# Altium schematic sheet pca10100_sheet4_interface_mcu.SchDoc: PCA10100 - Interface MCU
size A3; Organization: Nordic Semiconductor; DocumentNumber: 4; SheetNumber: 4; SheetTotal: 7; CompanyName: Nordic Semiconductor
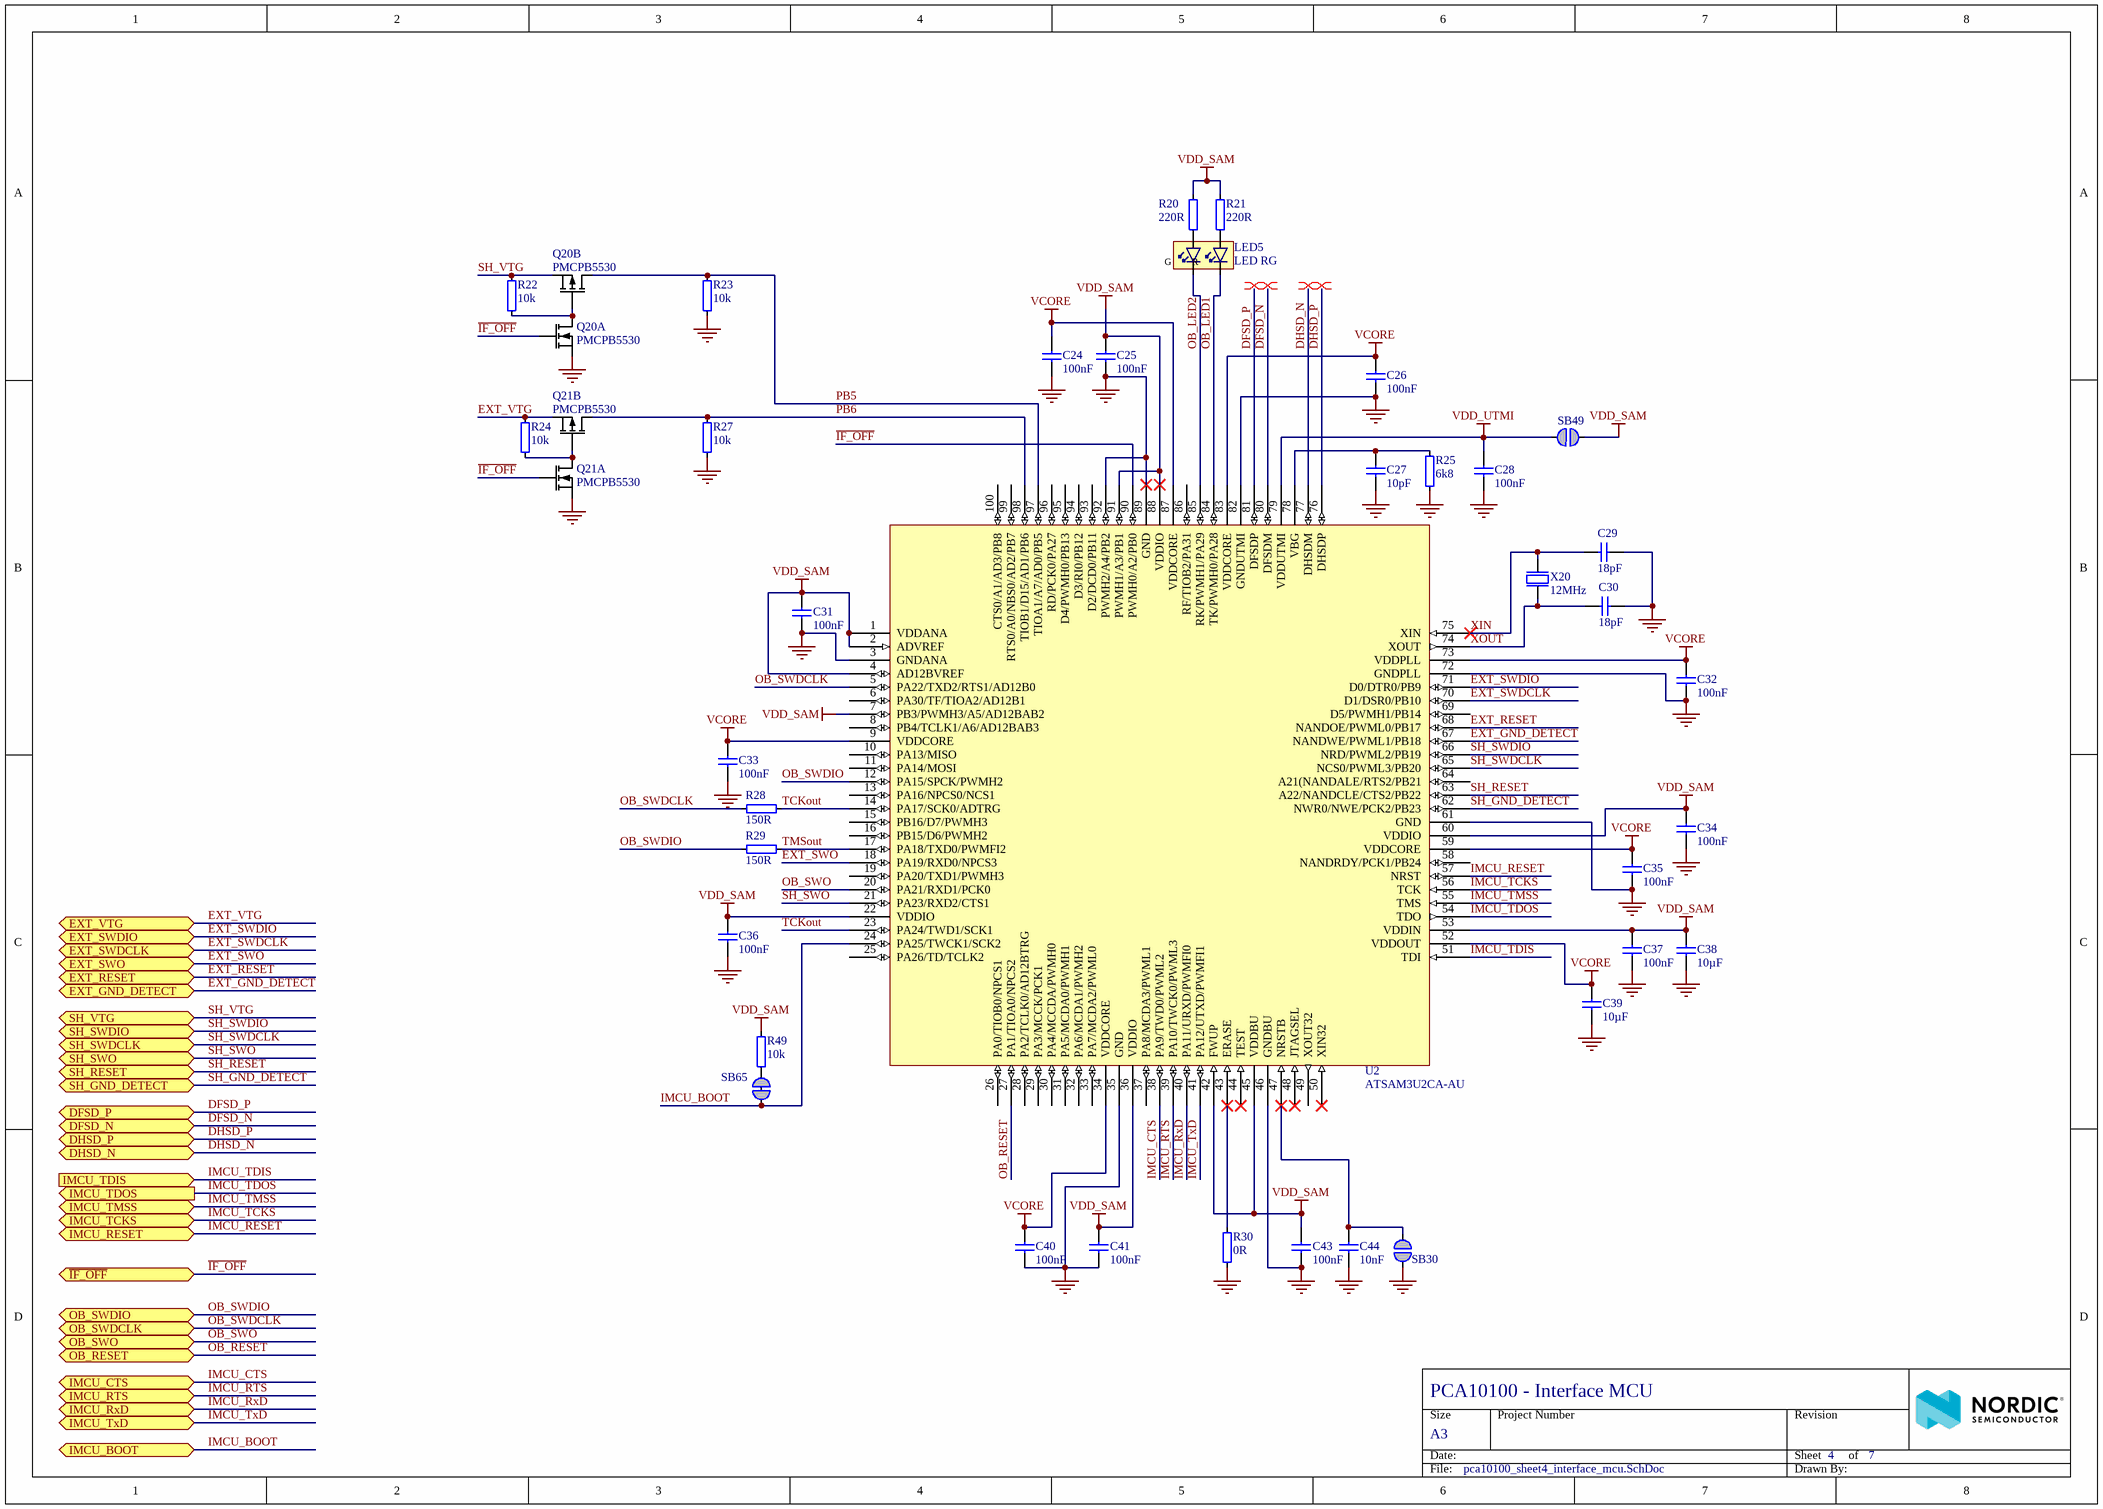
[diagram p0: pca10100_sheet4_interface_mcu.SchDoc]

## Parts
C24  100nF  [CAPC0603X03L_C]
C25  100nF  [CAPC0603X03L_C]
C26  100nF  [CAPC0603X03L_C]
C27  10pF  [CAPC0603X03L_C]
C28  100nF  [CAPC0603X03L_C]
C29  18pF  [CAPC0603X03L_C]
C30  18pF  [CAPC0603X03L_C]
C31  100nF  [CAPC0603X03L_C]
C32  100nF  [CAPC0603X03L_C]
C33  100nF  [CAPC0603X03L_C]
C34  100nF  [CAPC0603X03L_C]
C35  100nF  [CAPC0603X03L_C]
C36  100nF  [CAPC0603X03L_C]
C37  100nF  [CAPC0603X03L_C]
C38  10µF  [CAPC1608X06L]
C39  10µF  [CAPC1608X06L]
C40  100nF  [CAPC0603X03L_C]
C41  100nF  [CAPC0603X03L_C]
C43  100nF  [CAPC0603X03L_C]
C44  10nF  [CAPC0603X03L_C]
LED5  LED RG  [LED_DUAL_0606]
Q20  PMCPB5530  [DFN65P200X200X80_HS-6N]  (parts A,B of 2)
Q21  PMCPB5530  [DFN65P200X200X80_HS-6N]  (parts A,B of 2)
R20  220R  [RESC0603X03L_C]
R21  220R  [RESC0603X03L_C]
R22  10k  [RESC0603X03L_C]
R23  10k  [RESC0603X03L_C]
R24  10k  [RESC0603X03L_C]
R25  6k8  [RESC0603X03L_C]
R27  10k  [RESC0603X03L_C]
R28  150R  [RESC0603X03L_C]
R29  150R  [RESC0603X03L_C]
R30  0R  [RESC0603X03L_C]
R49  10k  [RESC0603X03L_C]
SB30  Solderbridge  [Solderbridge]  (value not drawn)  (no BOM)
SB49  Solderbridge  [Solderbridge]  (value not drawn)  (no BOM)
SB65  Solderbridge  [Solderbridge_Shorted]  (value not drawn)  (net tie, no BOM)
U2  ATSAM3U2CA-AU  [TSQFP50P1600X1600X160-100N]
X20  12MHz  [BT-XTAL_3225]

## Ports
DFSD_N (bidir), DFSD_P (bidir), DHSD_N (bidir), DHSD_P (bidir), EXT_GND_DETECT (bidir), EXT_RESET (bidir), EXT_SWDCLK (bidir), EXT_SWDIO (bidir), EXT_SWO (bidir), EXT_VTG (bidir), IMCU_BOOT (bidir), IMCU_CTS (bidir), IMCU_RESET (bidir), IMCU_RTS (bidir), IMCU_RxD (bidir), IMCU_TCKS (bidir), IMCU_TDIS (in), IMCU_TDOS (out), IMCU_TMSS (bidir), IMCU_TxD (bidir), OB_RESET (bidir), OB_SWDCLK (bidir), OB_SWDIO (bidir), OB_SWO (bidir), SH_GND_DETECT (bidir), SH_RESET (bidir), SH_SWDCLK (bidir), SH_SWDIO (bidir), SH_SWO (bidir), SH_VTG (bidir), ~{IF_OFF} (bidir)

## Nets
GND: C24.1 C25.1 C26.1 C27.1 C28.1 C29.2 C30.2 C31.1 C32.2 C33.1 C34.1 C35.1 C36.1 C37.1 C38.1 C39.1 C40.1 C41.1 C43.1 C44.1 Q20.1(S1) Q21.1(S1) R23.1 R25.1 R27.1 R30.1 SB30.2 U2.3(GNDANA) U2.35(GND) U2.46(GNDBU) U2.61(GND) U2.72(GNDPLL) U2.82(GNDUTMI) U2.89(GND) U2.92(PWMH2/A4/PB2) X20.2(GND) X20.4(GND)
VCORE: C24.2 C26.2 C32.1 C33.2 C35.2 C39.2 C40.2 U2.9(VDDCORE) U2.34(VDDCORE) U2.52(VDDOUT) U2.59(VDDCORE) U2.73(VDDPLL) U2.83(VDDCORE) U2.87(VDDCORE)
VDD_SAM: C25.2 C31.2 C34.2 C36.2 C37.2 C38.2 C41.2 C43.2 R20.2 R21.2 R49.2 SB49.1 U2.1(VDDANA) U2.2(ADVREF) U2.4(AD12BVREF) U2.7(PB3/PWMH3/A5/AD12BAB2) U2.22(VDDIO) U2.36(VDDIO) U2.42(FWUP) U2.45(VDDBU) U2.53(VDDIN) U2.60(VDDIO) U2.88(VDDIO) U2.91(PWMH1/A3/PB1)
VDD_UTMI: C28.2 SB49.2 U2.79(VDDUTMI)
DFSD_N: U2.80(DFSDM) ; port DFSD_N
DFSD_P: U2.81(DFSDP) ; port DFSD_P
DHSD_N: U2.77(DHSDM) ; port DHSD_N
DHSD_P: U2.76(DHSDP) ; port DHSD_P
EXT_GND_DETECT: U2.67(NANDWE/PWML1/PB18) ; port EXT_GND_DETECT
EXT_RESET: U2.68(NANDOE/PWML0/PB17) ; port EXT_RESET
EXT_SWDCLK: U2.70(D1/DSR0/PB10) ; port EXT_SWDCLK
EXT_SWDIO: U2.71(D0/DTR0/PB9) ; port EXT_SWDIO
EXT_SWO: U2.18(PA19/RXD0/NPCS3) ; port EXT_SWO
EXT_VTG: Q21.4(S2) R24.1 ; port EXT_VTG
~{IF_OFF}: Q20.2(G1) Q21.2(G1) U2.90(PWMH0/A2/PB0) ; port ~{IF_OFF}
IMCU_BOOT: SB65.1 U2.24(PA25/TWCK1/SCK2) ; port IMCU_BOOT
IMCU_CTS: U2.38(PA9/TWD0/PWML2) ; port IMCU_CTS
IMCU_RESET: U2.57(NRST) ; port IMCU_RESET
IMCU_RTS: U2.39(PA10/TWCK0/PWML3) ; port IMCU_RTS
IMCU_RxD: U2.40(PA11/URXD/PWMFI0) ; port IMCU_RxD
IMCU_TCKS: U2.56(TCK) ; port IMCU_TCKS
IMCU_TDIS: U2.51(TDI) ; port IMCU_TDIS
IMCU_TDOS: U2.54(TDO) ; port IMCU_TDOS
IMCU_TMSS: U2.55(TMS) ; port IMCU_TMSS
IMCU_TxD: U2.41(PA12/UTXD/PWMFI1) ; port IMCU_TxD
OB_LED1: LED5.4(C1) U2.84(TK/PWMH0/PA28)
OB_LED2: LED5.3(C2) U2.85(RK/PWMH1/PA29)
OB_RESET: U2.27(PA1/TIOA0/NPCS2) ; port OB_RESET
OB_SWDCLK: R28.2 U2.5(PA22/TXD2/RTS1/AD12B0) ; port OB_SWDCLK
OB_SWDIO: R29.2 U2.12(PA15/SPCK/PWMH2) ; port OB_SWDIO
OB_SWO: U2.20(PA21/RXD1/PCK0) ; port OB_SWO
PB5: Q20.3(D2) R23.2 U2.97(TIOA1/A7/AD0/PB5)
PB6: Q21.3(D2) R27.2 U2.98(TIOB1/D15/AD1/PB6)
SH_GND_DETECT: U2.62(NWR0/NWE/PCK2/PB23) ; port SH_GND_DETECT
SH_RESET: U2.63(A22/NANDCLE/CTS2/PB22) ; port SH_RESET
SH_SWDCLK: U2.65(NCS0/PWML3/PB20) ; port SH_SWDCLK
SH_SWDIO: U2.66(NRD/PWML2/PB19) ; port SH_SWDIO
SH_SWO: U2.21(PA23/RXD2/CTS1) ; port SH_SWO
SH_VTG: Q20.4(S2) R22.1 ; port SH_VTG
TCKout: R28.1 U2.14(PA17/SCK0/ADTRG) U2.23(PA24/TWD1/SCK1)
TMSout: R29.1 U2.17(PA18/TXD0/PWMFI2)
XIN: C29.1 U2.75(XIN) X20.3(out)
XOUT: C30.1 U2.74(XOUT) X20.1(inp)
NetC27_2: C27.2 R25.2 U2.78(VBG)
NetC44_2: C44.2 SB30.1 U2.47(NRSTB)
NetLED5_1: LED5.1(A2) R20.1
NetLED5_2: LED5.2(A1) R21.1
NetQ20_5: Q20.5(G2) Q20.6(D1) R22.2
NetQ21_5: Q21.5(G2) Q21.6(D1) R24.2
NetR30_2: R30.2 U2.43(ERASE)
NetR49_1: R49.1 SB65.2

Not connected (* = marked no-connect by the designer): U2 6(PA30/TF/TIOA2/AD12B1) 8(PB4/TCLK1/A6/AD12BAB3) 10(PA13/MISO) 11(PA14/MOSI) 13(PA16/NPCS0/NCS1) 15(PB16/D7/PWMH3) 16(PB15/D6/PWMH2) 19(PA20/TXD1/PWMH3) 25(PA26/TD/TCLK2) 26(PA0/TIOB0/NPCS1) 28(PA2/TCLK0/AD12BTRG) 29(PA3/MCCK/PCK1) 30(PA4/MCCDA/PWMH0) 31(PA5/MCDA0/PWMH1) 32(PA6/MCDA1/PWMH2) 33(PA7/MCDA2/PWML0) 37(PA8/MCDA3/PWML1) 44(TEST)* 48(JTAGSEL)* 49(XOUT32) 50(XIN32)* 58(NANDRDY/PCK1/PB24) 64(A21(NANDALE/RTS2/PB21) 69(D5/PWMH1/PB14) 86(RF/TIOB2/PA31) 93(D2/DCD0/PB11) 94(D3/RI0/PB12) 95(D4/PWMH0/PB13) 96(RD/PCK0/PA27) 99(RTS0/A0/NBS0/AD2/PB7) 100(CTS0/A1/AD3/PB8)

## Layout directives
differential pair: DFSD_N, DFSD_P, DHSD_N, DHSD_P

## Notes on the sheet
- Size
- Date:
- A3
- Project Number
- Sheet         of
- Revision
- File:
- Drawn By:
- (in symbol LTST-C195KGJRKT) G; R

## Library data of the parts
C24-C26 C28 C31-C37 C40 C41 C43 = C0201-100n: Capacitor, X5R, ±10%; Part number IPS: 00000001248; Note: 16V; Artikkelnr Noca: N.A.; Part Number: C0201-100n; Manufacturer: *; Manufacturer Part Number: *; LatestRevisionDate: 2017-11-09; Pin Count: 2; Publisher: Nordic Semiconductor; Published: 2014-11-13; Value: 100nF; Footprint Doc: 0201; ComponentLink1URL: *; ComponentLink1Description: Datasheet; ComponentLink2URL: *; ComponentLink2Description: Supplier link; HelpURL: *; Supplier 1: *; Supplier Part Number 1: *; Supplier 2: *; Supplier Part Number 2: *
C27 = C0201-10p: Capacitor, NP0, ±5%, 25V; Note: Chip Cap 1%; Artikkelnr Noca: N.A.; Part Number: C0201-10p; Manufacturer: *; Manufacturer Part Number: *; LatestRevisionDate: 2014-11-13; Pin Count: 2; Publisher: Nordic Semiconductor; Published: 2014-11-13; Value: 10pF; Footprint Doc: 0201; Part number IPS: N.A.; ComponentLink1URL: *; ComponentLink1Description: Datasheet; ComponentLink2URL: *; ComponentLink2Description: Supplier link; HelpURL: *; Supplier 1: *; Supplier Part Number 1: *; Supplier 2: *; Supplier Part Number 2: *
C29 C30 = C0201-18p: Capacitor, NP0, ±2%, 25V; Note: Chip Cap 1%; Artikkelnr Noca: N.A.; Part Number: C0201-18p; Manufacturer: *; Manufacturer Part Number: *; LatestRevisionDate: 2014-11-13; Pin Count: 2; Publisher: Nordic Semiconductor; Published: 2014-11-13; Value: 18pF; Footprint Doc: 0201; Part number IPS: N.A.; ComponentLink1URL: *; ComponentLink1Description: Datasheet; ComponentLink2URL: *; ComponentLink2Description: Supplier link; HelpURL: *; Supplier 1: *; Supplier Part Number 1: *; Supplier 2: *; Supplier Part Number 2: *
C38 C39 = C0603-10µ: Capacitor, X5R, ±20%; Part number IPS: 00000007785; Note: 6.3V; Artikkelnr Noca: 20039234; Part Number: C0603-10µ; Manufacturer: *; Manufacturer Part Number: *; LatestRevisionDate: 2011-01-17; Pin Count: 2; Publisher: Nordic Semiconductor; Published: 2011-01-17; Value: 10µF; Footprint Doc: 0603; ComponentLink1URL: *; ComponentLink1Description: Datasheet; ComponentLink2URL: *; ComponentLink2Description: Supplier link; HelpURL: *; Supplier 1: *; Supplier Part Number 1: *; Supplier 2: *; Supplier Part Number 2: *
C44 = C0201-10n: Capacitor, X7R, ±10%; Part number IPS: 00000003480; Note: 10V; Artikkelnr Noca: N.A.; Part Number: C0201-10n; Manufacturer: *; Manufacturer Part Number: *; LatestRevisionDate: 2017-11-09; Pin Count: 2; Publisher: Nordic Semiconductor; Published: 2014-11-13; Value: 10nF; Footprint Doc: 0201; ComponentLink1URL: *; ComponentLink1Description: Datasheet; ComponentLink2URL: *; ComponentLink2Description: Supplier link; HelpURL: *; Supplier 1: *; Supplier Part Number 1: *; Supplier 2: *; Supplier Part Number 2: *
LED5 = LTST-C195KGJRKT: Ultra bright AlInGaP Bi-Color LED; Manufacturer: Lite-On Inc; Part number IPS: N.A.; Artikkelnr Noca: 13019145; Part Number: LTST-C195KGJRKT; Manufacturer Part Number: LTST-C195KGJRKT; LatestRevisionDate: 2013-02-11; Pin Count: 4; Publisher: Nordic Semiconductor; Published: 2012-07-05; Value: LED RG; Note: *; Footprint Doc: LED_DUAL_0606; ComponentLink1URL: *; ComponentLink1Description: Datasheet; ComponentLink2URL: *; ComponentLink2Description: Supplier link; HelpURL: http://media.digikey.com/pdf/Data%20Sheets/Lite-On%20PDFs/LTST-C195KGJRKT.pdf; Supplier 1: Digi-Key; Supplier Part Number 1: 160-1452-1-ND; Supplier 2: Mouser; Supplier Part Number 2: 859-LTST-C195KGJRKT
Q20 Q21 = PMCPB5530X,115: Mosfet Array N and P-Channel 20V 4A (Ta), 3.4A (Ta) 490mW Surface Mount 6-HUSON-EP (2x2); Manufacturer: Nexperia; Artikkelnr Noca: N.A.; Part Number: PMCPB5530X,115; Manufacturer Part Number: PMCPB5530X,115; LatestRevisionDate: 2018-04-30; Pin Count: 8; Publisher: Nordic Semiconductor; Published: 2018-04-30; Value: PMCPB5530; Note: *; Footprint Doc: 6-UDFN; Part number IPS: N.A.; ComponentLink1URL: https://assets.nexperia.com/documents/data-sheet/PMCPB5530X.pdf; ComponentLink1Description: Datasheet; ComponentLink2URL: https://www.digikey.com/product-detail/en/nexperia-usa-inc/PMCPB5530X115/1727-1327-1-ND/4386339; ComponentLink2Description: Supplier link; HelpURL: https://www.nexperia.com/products/mosfets/small-signal-mosfets/PMCPB5530X.html; Supplier 1: Digi-Key; Supplier Part Number 1: 1727-1327-1-ND; Supplier 2: Mouser; Supplier Part Number 2: 771-PMCPB5530X115
R20 R21 = R0201-220: Resistor, ±1%, 0.05W; Part number IPS: 00000000863; Note: Chip Res 1%; Artikkelnr Noca: N.A.; Part Number: R0201-220; Manufacturer: *; Manufacturer Part Number: *; LatestRevisionDate: 2014-11-13; Pin Count: 2; Publisher: Nordic Semiconductor; Published: 2014-11-13; Value: 220R; Footprint Doc: 0201; ComponentLink1URL: *; ComponentLink1Description: Datasheet; ComponentLink2URL: *; ComponentLink2Description: Supplier link; HelpURL: *; Supplier 1: *; Supplier Part Number 1: *; Supplier 2: *; Supplier Part Number 2: *
R22-R24 R27 R49 = R0201-10k: Resistor, ±1%, 0.05W; Part number IPS: 00000001255; Note: Chip Res 1%; Artikkelnr Noca: N.A.; Part Number: R0201-10k; Manufacturer: *; Manufacturer Part Number: *; LatestRevisionDate: 2014-11-13; Pin Count: 2; Publisher: Nordic Semiconductor; Published: 2014-11-13; Value: 10k; Footprint Doc: 0201; ComponentLink1URL: *; ComponentLink1Description: Datasheet; ComponentLink2URL: *; ComponentLink2Description: Supplier link; HelpURL: *; Supplier 1: *; Supplier Part Number 1: *; Supplier 2: *; Supplier Part Number 2: *
R25 = R0201-6k8: Resistor, ±1%, 0.05W; Note: Chip Res 1%; Artikkelnr Noca: N.A.; Part Number: R0201-6k8; Manufacturer: *; Manufacturer Part Number: *; LatestRevisionDate: 2014-11-13; Pin Count: 2; Publisher: Nordic Semiconductor; Published: 2014-11-13; Value: 6k8; Footprint Doc: 0201; Part number IPS: N.A.; ComponentLink1URL: *; ComponentLink1Description: Datasheet; ComponentLink2URL: *; ComponentLink2Description: Supplier link; HelpURL: *; Supplier 1: *; Supplier Part Number 1: *; Supplier 2: *; Supplier Part Number 2: *
R28 R29 = R0201-150: Resistor, ±1%, 0.05W; Part number IPS: 00000001420; Note: Chip Res 1%; Artikkelnr Noca: N.A.; Part Number: R0201-150; Manufacturer: *; Manufacturer Part Number: *; LatestRevisionDate: 2014-11-13; Pin Count: 2; Publisher: Nordic Semiconductor; Published: 2014-11-13; Value: 150R; Footprint Doc: 0201; ComponentLink1URL: *; ComponentLink1Description: Datasheet; ComponentLink2URL: *; ComponentLink2Description: Supplier link; HelpURL: *; Supplier 1: *; Supplier Part Number 1: *; Supplier 2: *; Supplier Part Number 2: *
R30 = R0201-0R: Resistor, ±5%, 0.05W; Part number IPS: 00000003245; Note: Chip Res 5%; Artikkelnr Noca: N.A.; Part Number: R0201-0R; Manufacturer: *; Manufacturer Part Number: *; LatestRevisionDate: 2017-11-09; Pin Count: 2; Publisher: Nordic Semiconductor; Published: 2014-11-13; Value: 0R; Footprint Doc: 0201; ComponentLink1URL: *; ComponentLink1Description: Datasheet; ComponentLink2URL: *; ComponentLink2Description: Supplier link; HelpURL: *; Supplier 1: *; Supplier Part Number 1: *; Supplier 2: *; Supplier Part Number 2: *
SB30 SB49 = Solderbridge: Artikkelnr Noca: N.A.; Part Number: Solderbridge; Manufacturer: *; Manufacturer Part Number: *; LatestRevisionDate: 2009-12-14; Pin Count: 2; Publisher: Nordic Semiconductor; Published: 2009-12-14; Value: Solderbridge; Note: *; Footprint Doc: Solderbridge; Part number IPS: N.A.; ComponentLink1URL: *; ComponentLink1Description: Datasheet; ComponentLink2URL: *; ComponentLink2Description: Supplier link; HelpURL: *; Supplier 1: *; Supplier Part Number 1: *; Supplier 2: *; Supplier Part Number 2: *
SB65 = Solderbridge Shorted: Shorted Solderbridge; Artikkelnr Noca: N.A.; Part Number: Solderbridge Shorted; Manufacturer: *; Manufacturer Part Number: *; LatestRevisionDate: 2012-08-07; Pin Count: 2; Publisher: Nordic Semiconductor; Published: 2012-08-07; Value: Solderbridge; Note: *; Footprint Doc: Solderbridge_Shorted; Part number IPS: N.A.; ComponentLink1URL: *; ComponentLink1Description: Datasheet; ComponentLink2URL: *; ComponentLink2Description: Supplier link; HelpURL: *; Supplier 1: *; Supplier Part Number 1: *; Supplier 2: *; Supplier Part Number 2: *
U2 = ATSAM3U2CA-AU: IC MCU 32bit 128kB flash 100LQFP; Manufacturer: Atmel; Part number IPS: N.A.; Artikkelnr Noca: 15019073; Part Number: ATSAM3U2CA-AU; Manufacturer Part Number: ATSAM3U2CA-AU; LatestRevisionDate: 2012-06-01; Pin Count: 100; Publisher: Nordic Semiconductor; Published: 2012-06-01; Value: ATSAM3U2CA-AU; Note: *; Footprint Doc: LQFP-100; ComponentLink1URL: *; ComponentLink1Description: Datasheet; ComponentLink2URL: *; ComponentLink2Description: Supplier link; HelpURL: http://www.atmel.com/Images/6430s.pdf; Supplier 1: Digi-Key; Supplier Part Number 1: ATSAM3U2CA-AU-ND; Supplier 2: Farnell; Supplier Part Number 2: 184-1662
X20 = XTAL_SMD3225_12MHz_18pF_TXC: XTAL SMD 3225, 12MHz, Cl=18pF, Tol: ±30ppm, Stab: ±30ppm; Manufacturer: TXC Corporation; Manufacturer Part Number: 7M-12.000MAAJ-T; Part number IPS: N.A.; Note: XTAL SMD 12.000MHz; Artikkelnr Noca: 22019166; Part Number: XTAL_SMD3225_12MHz_18pF_TXC; LatestRevisionDate: 2014-11-27; Pin Count: 4; Publisher: Nordic Semiconductor; Published: 2010-08-31; Value: 12MHz; Footprint Doc: XTAL_3225; ComponentLink1URL: *; ComponentLink1Description: Datasheet; ComponentLink2URL: *; ComponentLink2Description: Supplier link; HelpURL: http://www.txccrystal.com/images/pdf/7m.pdf; Supplier 1: Digi-Key; Supplier Part Number 1: 887-1121-1-ND; Supplier 2: Farnell; Supplier Part Number 2: 184-2056